# Altium schematic sheet Sheet1_Power_MCU.SchDoc
size A4; SheetNumber: 1; SheetTotal: 1
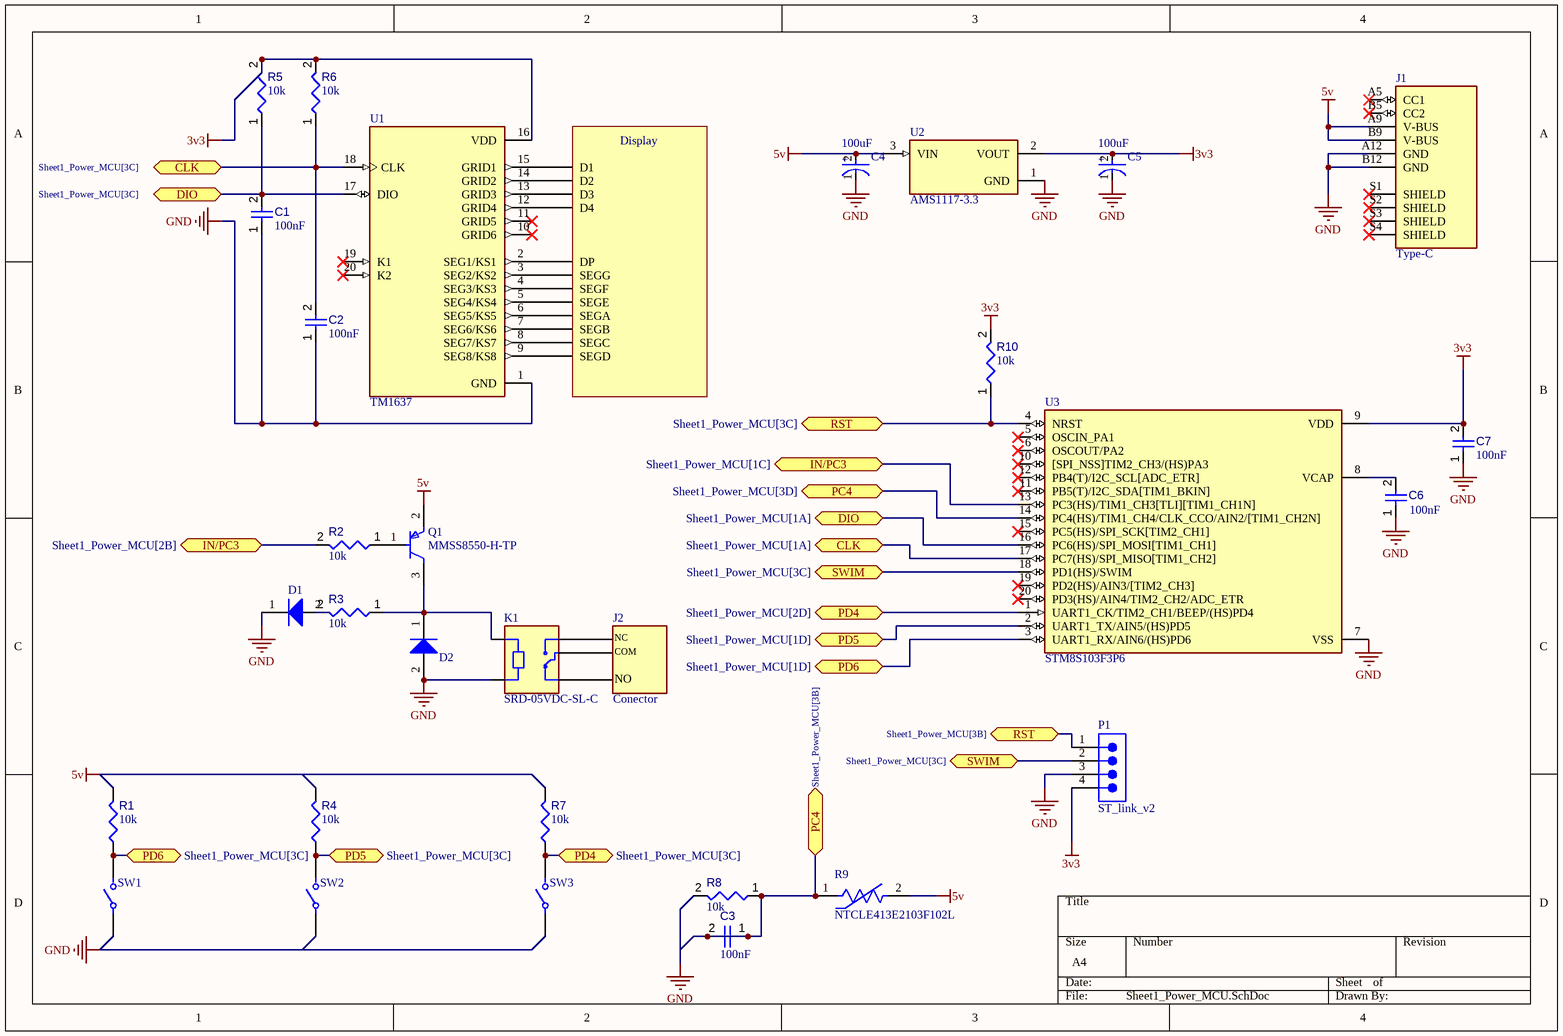
[diagram p0: Sheet1_Power_MCU.SchDoc]

## Parts
C1  value 100nF  [CAPC1608X90X40NL10T20]  (hidden comment: Capacitor 100 nF +/-10% 50 V 0603)
C2  value 100nF  [CAPC1608X90X40NL10T20]  (hidden comment: Capacitor 100 nF +/-10% 50 V 0603)
C3  value 100nF  [CAPC1608X90X40NL10T20]  (hidden comment: Capacitor 100 nF +/-10% 50 V 0603)
C4  Capacitance: 100uF  [FP-EEU-FR1H101B-MFG]  (hidden comment: EEU-FR1H101B)
C5  Capacitance: 100uF  [FP-EEU-FR1H101B-MFG]  (hidden comment: EEU-FR1H101B)
C6  value 100nF  [CAPC1608X90X40NL10T20]  (hidden comment: Capacitor 100 nF +/-10% 50 V 0603)
C7  value 100nF  [CAPC1608X90X40NL10T20]  (hidden comment: Capacitor 100 nF +/-10% 50 V 0603)
D1  BAT54HT1G  [ONSC-SOD-323-2-477-02_V]  (value not drawn)
D2  BAT54HT1G  [ONSC-SOD-323-2-477-02_V]  (value not drawn)
Display  Component_1  (value not drawn)
J1  Type-C  [CUI_UJC-HP-3-SMT-TR]
J2  Conector
K1  SRD-05VDC-SL-C  [RELAY_SRD-05VDC-SL-C]
P1  ST_link_v2  [61300411021]
Q1  MMSS8550-H-TP  [FP-SOT-23-IPC_B]
R1  value 10k  [RESC1005X40X25ML05T05]  (hidden comment: Resistor 10k +/-1% 0402 63 mW)
R2  value 10k  [RESC1005X40X25ML05T05]  (hidden comment: Resistor 10k +/-1% 0402 63 mW)
R3  value 10k  [RESC1005X40X25ML05T05]  (hidden comment: Resistor 10k +/-1% 0402 63 mW)
R4  value 10k  [RESC1005X40X25ML05T05]  (hidden comment: Resistor 10k +/-1% 0402 63 mW)
R5  value 10k  [RESC1005X40X25ML05T05]  (hidden comment: Resistor 10k +/-1% 0402 63 mW)
R6  value 10k  [RESC1005X40X25ML05T05]  (hidden comment: Resistor 10k +/-1% 0402 63 mW)
R7  value 10k  [RESC1005X40X25ML05T05]  (hidden comment: Resistor 10k +/-1% 0402 63 mW)
R8  value 10k  [RESC1005X40X25ML05T05]  (hidden comment: Resistor 10k +/-1% 0402 63 mW)
R9  NTCLE413E2103F102L  [FP-NTCLE413E2103F102L-MFG]
R10  value 10k  [RESC1005X40X25ML05T05]  (hidden comment: Resistor 10k +/-1% 0402 63 mW)
SW1  EVQ-QJJ05Q  [FP-EVQ-QJJ05Q-MFG]  (value not drawn)
SW2  EVQ-QJJ05Q  [FP-EVQ-QJJ05Q-MFG]  (value not drawn)
SW3  EVQ-QJJ05Q  [FP-EVQ-QJJ05Q-MFG]  (value not drawn)
U1  TM1637  [DIP778W43P254L2612H431Q20N]
U2  AMS1117-3.3  [SOT229P700X180-4N]
U3  STM8S103F3P6  [SOP65P640X120-20N]

## Ports
CLK (bidir, see Sheet1_Power_MCU[1A]), CLK (bidir, see Sheet1_Power_MCU[3C]), DIO (bidir, see Sheet1_Power_MCU[1A]), DIO (bidir, see Sheet1_Power_MCU[3C]), IN/PC3 (bidir, see Sheet1_Power_MCU[1C]), IN/PC3 (bidir, see Sheet1_Power_MCU[2B]), PC4 (bidir, see Sheet1_Power_MCU[3B]), PC4 (bidir, see Sheet1_Power_MCU[3D]), PD4 (bidir, see Sheet1_Power_MCU[2D]), PD4 (bidir, see Sheet1_Power_MCU[3C]), PD5 (bidir, see Sheet1_Power_MCU[1D]), PD5 (bidir, see Sheet1_Power_MCU[3C]), PD6 (bidir, see Sheet1_Power_MCU[1D]), PD6 (bidir, see Sheet1_Power_MCU[3C]), RST (bidir, see Sheet1_Power_MCU[3B]), RST (bidir, see Sheet1_Power_MCU[3C]), SWIM (bidir, see Sheet1_Power_MCU[3C])

## Nets
3v3: C5.2(A) C7.2 P1.4 R5.2 R6.2 R10.2 U1.16(VDD) U2.2(VOUT) U3.9(VDD)
5v: C4.2(A) J1.A9(V-BUS) J1.B9(V-BUS) Q1.2(E) R9.2 U2.3(VIN)
GND: C1.1 C2.1 C4.1(C) C5.1(C) C6.1 C7.1 D1.1(K) D2.2(A) J1.A12(GND) J1.B12(GND) K1.A2 P1.3 U1.1(GND) U2.1(GND) U3.7(VSS)
CLK: C2.2 R6.1 U1.18(CLK) U3.17(PC7(HS)/SPI_MISO[TIM1_CH2]) ; port CLK
DIO: C1.2 R5.1 U1.17(DIO) U3.16(PC6(HS)/SPI_MOSI[TIM1_CH1]) ; port DIO
IN/PC3: R2.2 U3.13(PC3(HS)/TIM1_CH3[TLI][TIM1_CH1N]) ; port IN/PC3
PC4: C3.1 C3.2 R8.1 R9.1 U3.14(PC4(HS)/TIM1_CH4/CLK_CCO/AIN2/[TIM1_CH2N]) ; port PC4
PD4: R7.1 SW3.B U3.1(UART1_CK/TIM2_CH1/BEEP/(HS)PD4) ; port PD4
PD5: R4.1 SW2.B U3.2(UART1_TX/AIN5/(HS)PD5) ; port PD5
PD6: R1.1 SW1.B U3.3(UART1_RX/AIN6/(HS)PD6) ; port PD6
RST: P1.1 R10.1 U3.4(NRST) ; port RST
SWIM: P1.2 U3.18(PD1(HS)/SWIM) ; port SWIM
NetC6_2: C6.2 U3.8(VCAP)
NetD1_2: D1.2(A) R3.2
NetD2_1: D2.1(K) K1.A1 Q1.3(C) R3.1
NetDisplay_D1: Display.D1 U1.15(GRID1)
NetDisplay_D2: Display.D2 U1.14(GRID2)
NetDisplay_D3: Display.D3 U1.13(GRID3)
NetDisplay_D4: Display.D4 U1.12(GRID4)
NetDisplay_DP: Display.DP U1.2(SEG1/KS1)
NetDisplay_SEGA: Display.SEGA U1.6(SEG5/KS5)
NetDisplay_SEGB: Display.SEGB U1.7(SEG6/KS6)
NetDisplay_SEGC: Display.SEGC U1.8(SEG7/KS7)
NetDisplay_SEGD: Display.SEGD U1.9(SEG8/KS8)
NetDisplay_SEGE: Display.SEGE U1.5(SEG4/KS4)
NetDisplay_SEGF: Display.SEGF U1.4(SEG3/KS3)
NetDisplay_SEGG: Display.SEGG U1.3(SEG2/KS2)
NetJ2_COM: J2.COM K1.COM
NetJ2_NC: J2.NC K1.NO
NetJ2_NO: J2.NO K1.NC
NetQ1_1: Q1.1(B) R2.1

Not connected (* = marked no-connect by the designer): J1 A5(CC1)* B5(CC2)* S1(SHIELD)* S2(SHIELD)* S3(SHIELD)* S4(SHIELD)*; R1 2; R4 2; R7 2; R8 2; SW1 A; SW2 A; SW3 A; U1 10(GRID6)* 11(GRID5)* 19(K1)* 20(K2)*; U3 5(OSCIN_PA1)* 6(OSCOUT/PA2)* 10([SPI_NSS]TIM2_CH3/(HS)PA3)* 11(PB5(T)/I2C_SDA[TIM1_BKIN])* 12(PB4(T)/I2C_SCL[ADC_ETR])* 15(PC5(HS)/SPI_SCK[TIM2_CH1])* 19(PD2(HS)/AIN3/[TIM2_CH3])* 20(PD3(HS)/AIN4/TIM2_CH2/ADC_ETR)*

## Notes on the sheet
- (in symbol CMP-05427-000020-1) +

## Library data of the parts
C1-C3 C6 C7 = CMP-001-00017-6: Chip Capacitor, 100 nF, +/- 10%, 50 V, 0603 (1608 Metric); Voltage Rating: 50V; Capacitor Type: Ceramic; Tolerance: 10%; Mounting Technology: SM; Max Operating Temperature: 125°C; RoHS Compliant: True; Pins: 2; Case/Package: 0603; Min Operating Temperature: -55°C
C4 C5 = CMP-05427-000020-1: CAP ALUM 100UF 20% 50V RADIAL; Life (Hours): 6000Hour; Ripple Current: 870mA; Lead Diameter: 0.6mm; Impedance: 61mR; Tolerance: 20%; Mount: Through Hole; Lead Free: Lead Free; Length: 11.5mm; Height - Seated (Max): 0.512inch; Contact Plating: Tin; Termination: Radial; Series: FR; Max Operating Temperature: 105°C; Features: General Purpose; Min Operating Temperature: -40°C; RoHS Compliant: Yes; Height: 11.5mm; Voltage Rating (DC): 50V; Diameter: 8mm; Lead Pitch: 5mm; Radiation Hardening: No; Package Quantity: 1; Case/Package: Radial; Voltage Rating: 50V; Packaging: Tape and Reel; ESR (Equivalent Series Resistance): 61mR; REACH SVHC: No SVHC; Value: 100uF
D1 D2 = CMP-1055-00462-1: Schottky Barrier Diode, 2-Pin SOD-323, Pb-Free, Tape and Reel; Manufacturer: On Semiconductor; Configuration: Single; trr Max (ns): 5; IFSM Max (A): 0.6; ComponentLink3URL: http://www.onsemi.com/pub_link/Collateral/477-02.PDF.1; PackageDescription: 2-Pin SOD, Body 1.7 x 1.25 mm; ComponentLink2URL: http://www.onsemi.cn/pub_link/Collateral/BAT54HT1-D.PDF; ComponentLink3Description: Package Specification; ComponentLink2Description: Datasheet; DatasheetVersion: Rev. 6; PackageReference: SOD-323-2-477-02; RoHS: TRUE; ComponentLink1URL: http://www.onsemi.com/; Packing: Tape and Reel; PartNumber: BAT54HT1G; Mounting Technology: Surface Mount; ComponentLink1Description: Manufacturer URL; PackageVersion: Rev. H, 03/2007
J1 = UJC-HP-3-SMT-TR: Package: None; Price: None; Value: *; MP: UJC-HP-3-SMT-TR; Availability: Unavailable
J2 = Component_1
K1 = CMP-013-000000-1: 5V Trigger Relay Module For Arduino And Raspberry Pi 5V Trigger Relay Module For Arduino And Raspberry Pi; MF: Songle Relay; Source: SRD-05VDC-SL-C.SchLib; Check_prices: https://www.snapeda.com/parts/SRD-05VDC-SL-C/Songle+Relay/view-part/?ref=eda; Component Type: Standard; MP: SRD-05VDC-SL-C; SnapEDA_Link: https://www.snapeda.com/parts/SRD-05VDC-SL-C/Songle+Relay/view-part/?ref=snap; Price: None; Package: NON STANDARD-5 Songle Relay; Availability: Not in stock; Design Item ID: SRD-05VDC-SL-C; Value: *; Pin Count: 5
P1 = CMP-1502-01063-3: NexarPartId: 31153320; Current Rating: 3A; Number of Contacts: 4; Gender: Male; Operating Supply Voltage: 250V; Contact Resistance: 20mΩ; Connector Type: Male Pin; Pitch: 2.54mm; Contact Material: Copper; Number of Positions: 4; Color: Black; Contact Plating: Gold; Number of Pins: 4; Termination: Solder; Number of Rows: 1; Lead Pitch: 2.54mm; Mount: Through Hole; Contact Mating Length: 5.9944mm; RoHS: Compliant; REACH SVHC: Unknown
Q1 = CMP-56214-000002-1: TRANS PNP 25V 1.5A SOT23; Emitter Base Voltage (VEBO): 1.6V; Collector Base Voltage (VCBO): 40V; Collector Emitter Saturation Voltage: 500mV; Max Power Dissipation: 625mW; Transition Frequency: 100MHz; Element Configuration: Single; hFE Min: 40; Polarity: PNP; Lead Free: Lead Free; Max Breakdown Voltage: 25V; Package Quantity: 1; Min Operating Temperature: -55°C; Case/Package: SOT-23; Max Collector Current: 1.5A; Mount: Surface Mount; Packaging: Tape and Reel; Collector Emitter Voltage (VCEO): 500mV; Max Operating Temperature: 150°C; Gain Bandwidth Product: 100MHz; Collector Emitter Breakdown Voltage: 25V
R1-R8 R10 = CMP-009-00019-5: Chip Resistor, 10 KOhm, +/- 1%, 63 mW, -55 to 155 degC, 0402 (1005 Metric); Power: 63mW; Voltage Rating: 50V; Case/Package: 0402; Mounting Technology: SM; Pins: 2; Min Operating Temperature: -55°C; Tolerance: 1%; RoHS Compliant: True; Max Operating Temperature: 155°C
R9 = CMP-02404-000007-1: THERMISTOR NTC 10KOHM 3435K BEAD; Resistance Tolerance: 1%; Resistance: 10kR; Lead Diameter: 1mm; Max Power Dissipation: 250mW; Value: 10kR; Package Quantity: 100; Accuracy: 1%; Number of Pins: 2; Packaging: Bulk; Radiation Hardening: No; Min Operating Temperature: -40°C; Tolerance: 1%; Mount: Through Hole; Max Operating Temperature: 105°C; Termination: Through Hole; RoHS Compliant: Yes
SW1-SW3 = CMP-00287-56250562-1: EVQ-QJJ05Q Switch Tactile N.O. SPST Round Button PC Pins 0.005A 12VDC 0.8N Thru-Hole Radial T/R; Current Rating: 5mA; Life (Cycles): 1Mcycles; Switch Travel: 1mm; Illumination Type: Illuminated, Non-Illuminated; Operating Force: 800mN; Actuator Length: 1.5mm; Voltage Rating (DC): 12V; Contact Resistance: 200mΩ; Switch Function: Off-Mom; NexarPartId: 56250562; Contact Current Rating: 5mA; Radiation Hardening: No; Height: 5mm; Lead Free: Lead Free; Mechanical Life: 1Mcycles; REACH SVHC: No SVHC; RoHS: Compliant; Orientation: Straight; Case/Package: Axial; Contact Plating: Silver; Length: 8mm; Width: 8mm; Max Operating Temperature: 70°C; Max Voltage Rating (DC): 12V; Termination: PC Pin; Electrical Life: 1Mcycles; Throw Configuration: SPST; Mount: Through Hole; Packaging: Tape & Box (TB); Min Operating Temperature: -20°C
U1 = TM1637: LED Drive Control Special Circuit; MF: Titan Micro Electronics; SnapEDA_Link: https://www.snapeda.com/parts/TM1637/Titan+Micro+Electronics/view-part/?ref=snap; Package: None; Value: *; MP: TM1637; Check_prices: https://www.snapeda.com/parts/TM1637/Titan+Micro+Electronics/view-part/?ref=eda
U2 = CMP-031-00006-2: Linear Voltage Regulator IC Positive Fixed 1 Output 1A SOT-223-3L; MF: UMW; SnapEDA_Link: https://www.snapeda.com/parts/AMS1117-3.3/UMW/view-part/?ref=snap; Value: *; Pins: 3; Source: AMS1117-3.3.SchLib; Check_prices: https://www.snapeda.com/parts/AMS1117-3.3/UMW/view-part/?ref=eda; MP: AMS1117-3.3; Case/Package: SOT-223-3L UMW; Design Item ID: AMS1117-3.3; Component Type: Standard
U3 = STM8S103F3P6: STM8 series Microcontroller IC 8-Bit 16MHz 8KB (8K x 8) FLASH 20-TSSOP; MF: STMicroelectronics; SnapEDA_Link: https://www.snapeda.com/parts/STM8S103F3P6/STMicroelectronics/view-part/?ref=snap; Package: TSSOP-20 STMicroelectronics; Value: *; MP: STM8S103F3P6; Check_prices: https://www.snapeda.com/parts/STM8S103F3P6/STMicroelectronics/view-part/?ref=eda